# Altium schematic sheet MCU.SchDoc
size A4; SheetNumber: 3; SheetTotal: 3
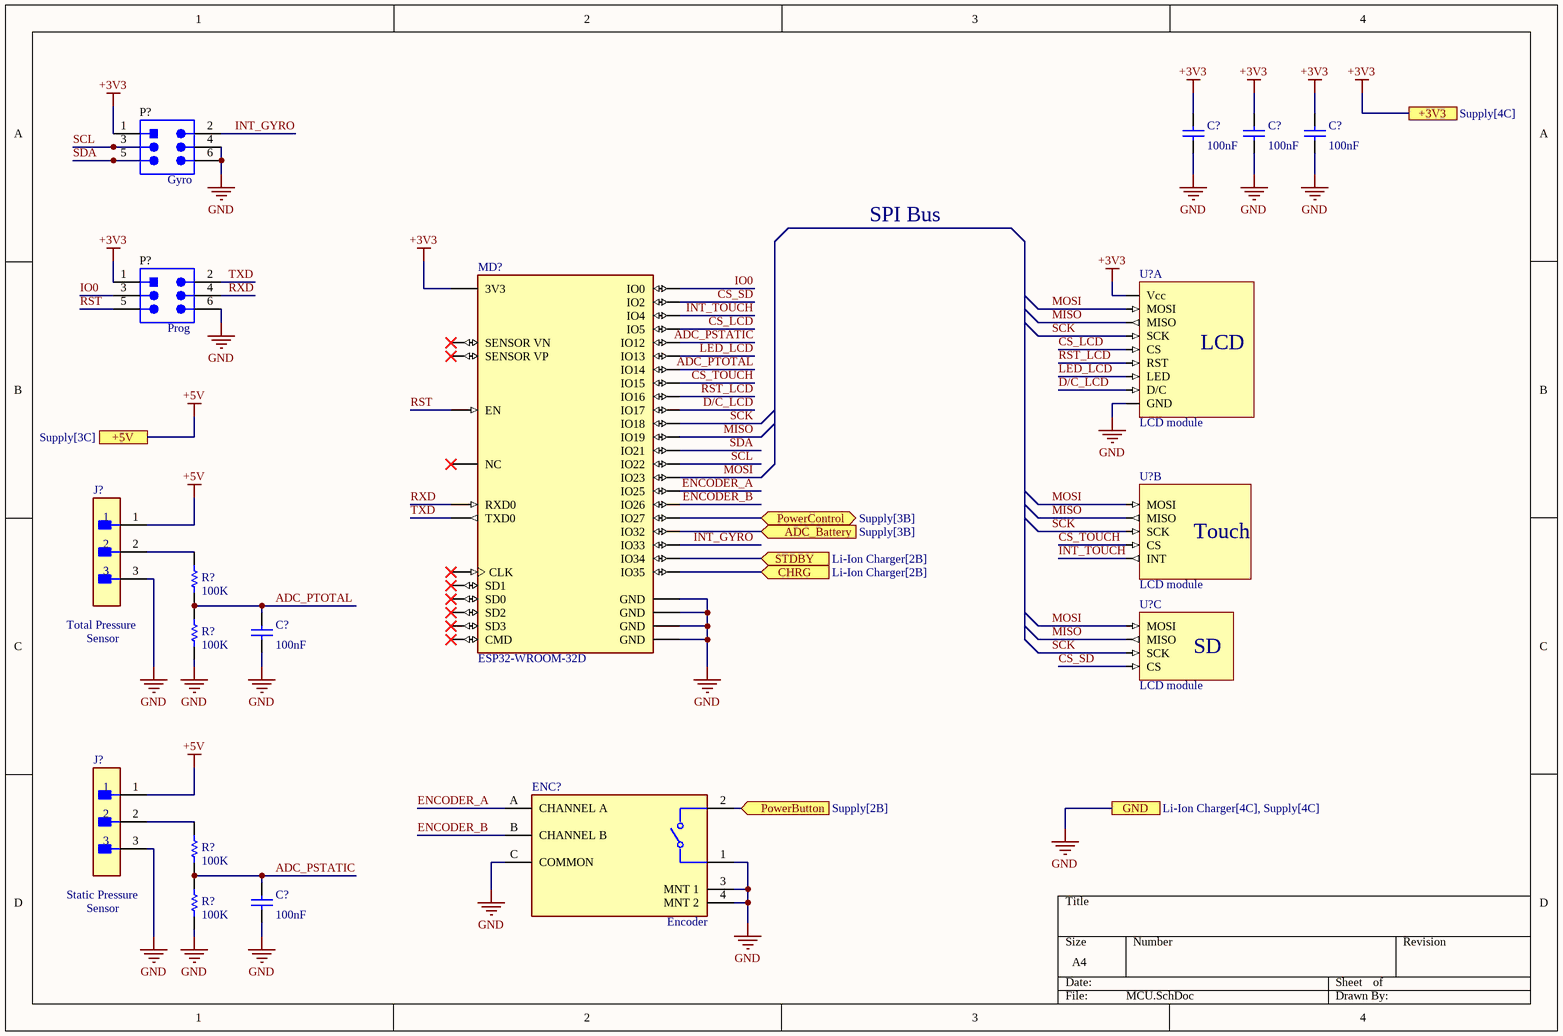
[diagram p0: MCU.SchDoc]

## Parts
(Parts that share a designator on the sheet are numbered #1, #2 ... from top to bottom, then left to right.)
C?#1  value 100nF  [CAPC2013X140X50LL20T25]  (hidden comment: capacitor smd 0805 100nF)
C?#2  value 100nF  [CAPC2013X140X50LL20T25]  (hidden comment: capacitor smd 0805 100nF)
C?#3  value 100nF  [CAPC2013X140X50LL20T25]  (hidden comment: capacitor smd 0805 100nF)
C?#4  value 100nF  [CAPC2013X140X50LL20T25]  (hidden comment: capacitor smd 0805 100nF)
C?#5  value 100nF  [CAPC2013X140X50LL20T25]  (hidden comment: capacitor smd 0805 100nF)
ENC?  Encoder 6mm  [FP-PEC11R-4220K-S0024-MFG]  (value not drawn)
J?#1  Goldpin 3 Pin 2.54mm  [FP-87224-3-MFG]  (value not drawn)
J?#2  Goldpin 3 Pin 2.54mm  [FP-87224-3-MFG]  (value not drawn)
MD?  ESP32-WROOM-32D  [FP-ESP32-WROOM-32D-MFG]
P?#1  Goldpin 2x3 Pin 2.54  [SMTC-TSW-103-08-L-D_V]  (value not drawn)
P?#2  Goldpin 2x3 Pin 2.54  [SMTC-TSW-103-08-L-D_V]  (value not drawn)
R?#1  value 100K  [RESC2013X50X30ML20T20]  (hidden comment: resistor smd 0805 1K)
R?#2  value 100K  [RESC2013X50X30ML20T20]  (hidden comment: resistor smd 0805 1K)
R?#3  value 100K  [RESC2013X50X30ML20T20]  (hidden comment: resistor smd 0805 1K)
R?#4  value 100K  [RESC2013X50X30ML20T20]  (hidden comment: resistor smd 0805 1K)
U?#1  LCD module  [LCD module-Footprint-1]  (part A of 3)
U?#2  LCD module  [LCD module-Footprint-1]  (part B of 3)
U?#3  LCD module  [LCD module-Footprint-1]  (part C of 3)

## Ports
+3V3 (see Supply[4C]), +5V (see Supply[3C]), ADC_Battery (in, see Supply[3B]), CHRG (in, see Li-Ion Charger[2B]), GND (see Li-Ion Charger[4C], Supply[4C]), PowerButton (in, see Supply[2B]), PowerControl (bidir, see Supply[3B]), STDBY (in, see Li-Ion Charger[2B])

## Nets
+3V3: C?#1.2 C?#2.2 C?#3.2 MD?.2(3V3) P?#1.1 P?#2.1 U?#1.1(Vcc) ; port +3V3
+5V: J?#1.1 J?#2.1 ; port +5V
GND: C?#1.1 C?#2.1 C?#3.1 C?#4.1 C?#5.1 ENC?.1 ENC?.3(MNT_1) ENC?.4(MNT_2) ENC?.C(COMMON) J?#1.3 J?#2.3 MD?.1(GND) MD?.15(GND) MD?.38(GND) MD?.39(GND) P?#1.4 P?#1.6 P?#2.6 R?#2.1 R?#4.1 U?#1.2(GND) ; port GND
ADC_Battery: MD?.8(IO32) ; port ADC_Battery
ADC_PSTATIC: C?#5.2 MD?.14(IO12) R?#3.1 R?#4.2
ADC_PTOTAL: C?#4.2 MD?.13(IO14) R?#1.1 R?#2.2
CHRG: MD?.7(IO35) ; port CHRG
CS_LCD: MD?.29(IO5) U?#1.3(CS)
CS_SD: MD?.24(IO2) U?#3.15(CS)
CS_TOUCH: MD?.23(IO15) U?#2.11(CS)
D/C_LCD: MD?.28(IO17) U?#1.5(D/C)
ENCODER_A: ENC?.A(CHANNEL_A) MD?.10(IO25)
ENCODER_B: ENC?.B(CHANNEL_B) MD?.11(IO26)
INT_GYRO: MD?.9(IO33) P?#1.2
INT_TOUCH: MD?.26(IO4) U?#2.14(INT)
IO0: MD?.25(IO0) P?#2.3
LED_LCD: MD?.16(IO13) U?#1.8(LED)
MISO: MD?.31(IO19) U?#1.9(MISO) U?#2.13(MISO) U?#3.17(MISO)
MOSI: MD?.37(IO23) U?#1.6(MOSI) U?#2.12(MOSI) U?#3.16(MOSI)
PowerButton: ENC?.2 ; port PowerButton
PowerControl: MD?.12(IO27) ; port PowerControl
RST: MD?.3(EN) P?#2.5
RST_LCD: MD?.27(IO16) U?#1.4(RST)
RXD: MD?.34(RXD0) P?#2.4
SCK: MD?.30(IO18) U?#1.7(SCK) U?#2.10(SCK) U?#3.18(SCK)
SCL: MD?.36(IO22) P?#1.3
SDA: MD?.33(IO21) P?#1.5
STDBY: MD?.6(IO34) ; port STDBY
TXD: MD?.35(TXD0) P?#2.2
NetJ?#1_2: J?#1.2 R?#1.2
NetJ?#2_2: J?#2.2 R?#3.2

Not connected (* = marked no-connect by the designer): MD? 4(SENSOR_VP)* 5(SENSOR_VN)* 17(SD2)* 18(SD3)* 19(CMD)* 20(CLK)* 21(SD0)* 22(SD1)* 32(NC)*

## Notes on the sheet
- (near P?#1) Gyro
- SPI Bus
- (near P?#2) Prog
- Total Pressure
- Sensor
- Static Pressure
- (near ENC?) Encoder
- (in symbol CMP-00026-00002-3, part A) LCD
- (in symbol CMP-00026-00002-3, part B) Touch
- (in symbol CMP-00026-00002-3, part C) SD

## Library data of the parts
C?#1-C?#5 = CMP-001-00085-1: Cap Ceramic 0.1uF 50V X7R 10% Pad SMD 0805 FlexiTerm 125C Automotive T/R
ENC? = CMP-011-00013-1: 24 Pulse Incremental Mechanical Rotary Encoder w/ 6 mm Knurl Shaft; Through Hole
J?#1 J?#2 = CMP-002-00075-1: Header; Standard; PCB Mount; Single; 3; 0.025 in.; 0.125 in.; Square; 0.1 in.
MD? = CMP-020-00024-1: Wi-Fi/BT BLE Module ESP32-D0WD, SPI Flash, UART, P
P?#1 P?#2 = CMP-002-00076-1: Conn Unshrouded Header HDR 6 POS 2.54mm Solder ST Top Entry Thru-Hole Bag
R?#1-R?#4 = CMP-009-00179-1: Res Thick Film 0805 1K Ohm 1% 1/8W ±100ppm/°C Molded SMD Paper T/R
U?#1-U?#3 = CMP-00026-00002-3: modul wyswietlacza TFT z kontrolerem touch i karta SD